# Altium schematic sheet USB.SchDoc: USB
size 279 x 215 mm; CheckedBy: Lance Bantoto; Engineer: Ari Wasch; Revision: 1; SheetNumber: 3; SheetTotal: 3
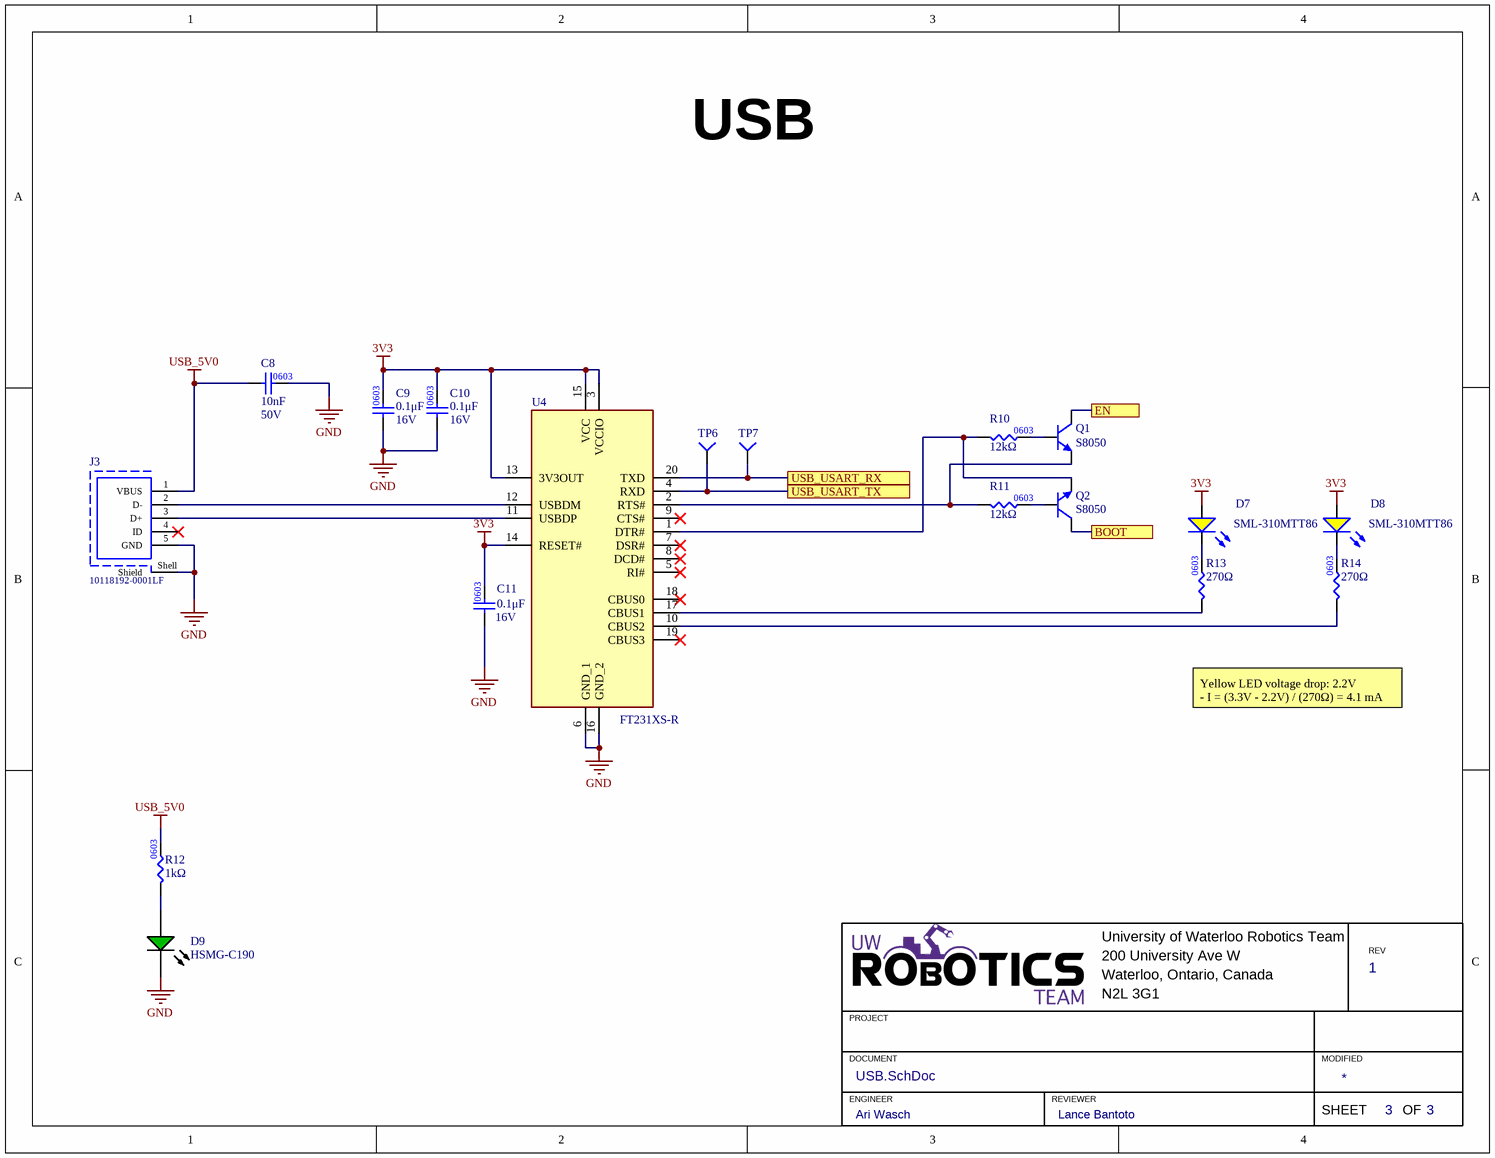
[diagram p0: USB.SchDoc]

## Parts
C8  value 10nF  Voltage Rating: 50V  [CAP0603]  (hidden comment: CAP_10nF_50V_0603)
C9  value 0.1μF  Voltage Rating: 16V  [CAP0603]  (hidden comment: CAP_0.1uF_16V_0603)
C10  value 0.1μF  Voltage Rating: 16V  [CAP0603]  (hidden comment: CAP_0.1uF_16V_0603)
C11  value 0.1μF  Voltage Rating: 16V  [CAP0603]  (hidden comment: CAP_0.1uF_16V_0603)
D7  Manufacturer Part Number 1: SML-310MTT86  [LED_0805_YELLOW]  (hidden comment: LED_YELLOW)
D8  Manufacturer Part Number 1: SML-310MTT86  [LED_0805_YELLOW]  (hidden comment: LED_YELLOW)
D9  HSMG-C190  [AVAG-HSMX-C190_V]
J3  10118192-0001LF  [629105136821]
Q1  Manufacturer Part Number 1: S8050  [SOT23-3]  (hidden comment: NPN_25V_500mA)
Q2  Manufacturer Part Number 1: S8050  [SOT23-3]  (hidden comment: NPN_25V_500mA)
R10  value 12kΩ  [RESC0603]  (hidden comment: RES_12kΩ_0603)
R11  value 12kΩ  [RESC0603]  (hidden comment: RES_12kΩ_0603)
R12  value 1kΩ  [RES0603]  (hidden comment: RES_1kΩ_0603_5%)
R13  value 270Ω  [RES0603]  (hidden comment: RES_270Ω_0603_1%)
R14  value 270Ω  [RES0603]  (hidden comment: RES_270Ω_0603_1%)
TP6  TESTPOINT_1MM_SQUARE  [TESTPOINT_SQUARE_1MM]  (value not drawn)  (no BOM)
TP7  TESTPOINT_1MM_SQUARE  [TESTPOINT_SQUARE_1MM]  (value not drawn)  (no BOM)
U4  FT231XS-R  [SOP64P599X175-20N]

## Ports
BOOT, EN, USB_USART_RX, USB_USART_TX

## Nets
3V3: C9.2 C10.2 C11.2 D7.1(A) D8.1(A) U4.3(VCCIO) U4.13(3V3OUT) U4.14(RESET#) U4.15(VCC)
GND: C8.2 C9.1 C10.1 C11.1 D9.2(K) J3.5(GND) J3.Shell(Shield) U4.6(GND_1) U4.16(GND_2)
USB_5V0: C8.1 J3.1(VBUS) R12.2
BOOT: Q2.3(C) ; port BOOT
EN: Q1.3(C) ; port EN
USB_USART_RX: TP7.1(=value) U4.20(TXD) ; port USB_USART_RX
USB_USART_TX: TP6.1(=value) U4.4(RXD) ; port USB_USART_TX
NetD7_2: D7.2(K) R13.2
NetD8_2: D8.2(K) R14.2
NetD9_1: D9.1(A) R12.1
NetJ3_2: J3.2(D-) U4.12(USBDM)
NetJ3_3: J3.3(D+) U4.11(USBDP)
NetQ1_1: Q1.1(B) R10.2
NetQ1_2: Q1.2(E) R11.1 U4.2(RTS#)
NetQ2_1: Q2.1(B) R11.2
NetQ2_2: Q2.2(E) R10.1 U4.1(DTR#)
NetR13_1: R13.1 U4.17(CBUS1)
NetR14_1: R14.1 U4.10(CBUS2)

Not connected (* = marked no-connect by the designer): J3 4(ID)*; U4 5(RI#)* 7(DSR#)* 8(DCD#)* 9(CTS#)* 18(CBUS0)* 19(CBUS3)*

## Notes on the sheet
- Yellow LED voltage drop: 2.2V
  - I = (3.3V - 2.2V) / (270Ω) = 4.1 mA
- University of Waterloo Robotics Team
- 200 University Ave W
- REV
- PROJECT
- Waterloo, Ontario, Canada
- N2L 3G1
- DOCUMENT
- ENGINEER
- REVIEWER
- MODIFIED
- SHEET
- OF
- (in symbol CAP_10nF_50V_0603) 0603

## Library data of the parts
C8 = CAP_10nF_50V_0603: CAP CER 10nF 50V X7R 0603; Manufacturer 1: YAGEO; Manufacturer Part Number 1: CC0603KRX7R9BB103; Dielectric: X7R; Supplier 1: LCSC; LCSC Number: C100042
C9-C11 = CAP_0.1uF_16V_0603: CAP CER 0.1UF 16V X7R 0603; Manufacturer Part Number 1: CC0603KRX7R7BB104; Manufacturer 1: Yageo; Package/Footprint: 0603; Supplier Part Number 1: 311-1088-1-ND; Supplier 1: Digi-Key; Dielectric: X7R; LCSC Number: C108079
D7 D8 = LED_YELLOW: LED YELLOW DIFFUSED 0805 SMD; Manufacturer 1: Everlight Elec; Forward Voltage Drop: 2.2V; Package: 0805 (2012 Metric); Supplier 1: LCSC; LCSC Number: C122984
D9 = CMP-1744-00002-1: Chip LED, Green, 2.2 V, -40 to 85 degC, 2-Pin SMD, RoHS, Tape and Reel; Frequency: 400 KHz; Max Supply Voltage: 5.5 V; Access Time: 3500 ns; Clock Frequency: 100 KHz; Case\Package: SOIC; Density: 32 kb; Nominal Supply Current: 2 mA; Interface: Serial; Min Supply Voltage: 1.7 V; Packaging: Tape and Reel; PackageReference: HSMX-C190; ComponentLink2URL: http://docs.avagotech.com/docs/AV02-0551EN; RoHSCompliant: true; Pins: 8; REACH SVHC: No SVHC; Max Operating Temperature: 85 degC; Width: 4 mm; Radiation Hardening: No; Package Quantity: 3000; ComponentLink3Description: Package Specification; ComponentLink1Description: Manufacturer URL; Min Operating Temperature: -40 degC; PackageDescription: 2-Pin Surface Mount Device, Body 1.6 x 0.8 mm, Height 0.9 mm; Max Clock Frequency: 100 KHz; Height: 1.5 mm; ComponentLink1URL: http://www.avagotech.com/; DatasheetVersion: Mar-12; ComponentLink2Description: Datasheet; Mount: Surface Mount; Length: 5 mm; ComponentLink3URL: http://www.fairchildsemi.com/dwg/MA/MA03D.pdf; LCSC Number: C188729
J3 = WE 629105136821: CONN RCPT USB2.0 MICRO B SMD R/A; Manufacturer: Amphenol ICC; Contact Resistance: 30mOhm; Rated Current: 1A; Working Voltage: 30VAC; Connector Type: MicroUSB2.0TypeB; Gender: Receptacle; Datasheet URL: https://datasheet.lcsc.com/lcsc/1811131827_Amphenol-ICC-10118192-0001LF_C132564.pdf; Mounting Technology: SMD; Package Reference: 10118192-0001LF; Orientation: Horizontal; Part Number: 10118192-0001LF; Manufacturer URL: http://www.we-online.de; Operating Temperature: -40to105degC; LCSC Number: C132564
Q1 Q2 = NPN_25V_500mA: TRANS NPN 20V 0.5A SOT23; Manufacturer 1: Micro Commercial Co; Package: TO-236-3, SC-59, SOT-23-3; LCSC Number: C444723; Parameter 1: *
R10 R11 = RES_12kΩ_0603_1%: RES 12K OHM 1% 1/10W 0603; Manufacturer 1: Vishay Dale; Manufacturer Part Number 1: CRCW060312K0FKEAC; Power: 0.1W; Supplier Part Number 1: 541-4046-1-ND; Supplier 1: Digi-Key; LCSC Number: C163859; Manufacturer Part Number 2: WR06X1202FTL; Tolerance: 1%; Package: 0603
R12 = RES_1kΩ_0603_5%: RES 1K OHM 5% 1/10W 0603; Manufacturer 1: Yageo; Manufacturer Part Number 1: RC0603JR-071KL; Package/Footprint: 0603; Supplier Part Number 1: 311-1.0KGRCT-ND; Supplier 1: Digi-Key; Mounting Type: SMD; LCSC Number: C14676
R13 R14 = RES_270Ω_0603_1%: RES 270 OHM 1% 1/10W 0603; Manufacturer 1: UNI-ROYAL(Uniroyal Elec); Manufacturer Part Number 1: 0603WAF2700T5E; Power: 0.1W; LCSC Number: C22966; Package: 0603; Tolerance: ±1%
TP6 TP7 = TESTPOINT_1MM_SQUARE: TESTPOINT 1MM SQUARE
U4 = FT231XS-R: Integrated Circuit; Manufacturer_Name: FTDI Chip; Datasheet Link: http://docs-emea.rs-online.com/webdocs/1102/0900766b811020d3.pdf; Height: 1.753mm; Manufacturer_Part_Number: FT231XS-R; Mouser Part Number: 895-FT231XS-R; Mouser Price/Stock: https://www.mouser.co.uk/ProductDetail/FTDI/FT231XS-R?qs=Gp1Yz1mis3WduRPsgrTbtg%3D%3D; Arrow Part Number: FT231XS-R; Arrow Price/Stock: https://www.arrow.com/en/products/ft231xs-r/ftdi-chip?region=nac; LCSC Number: C132160